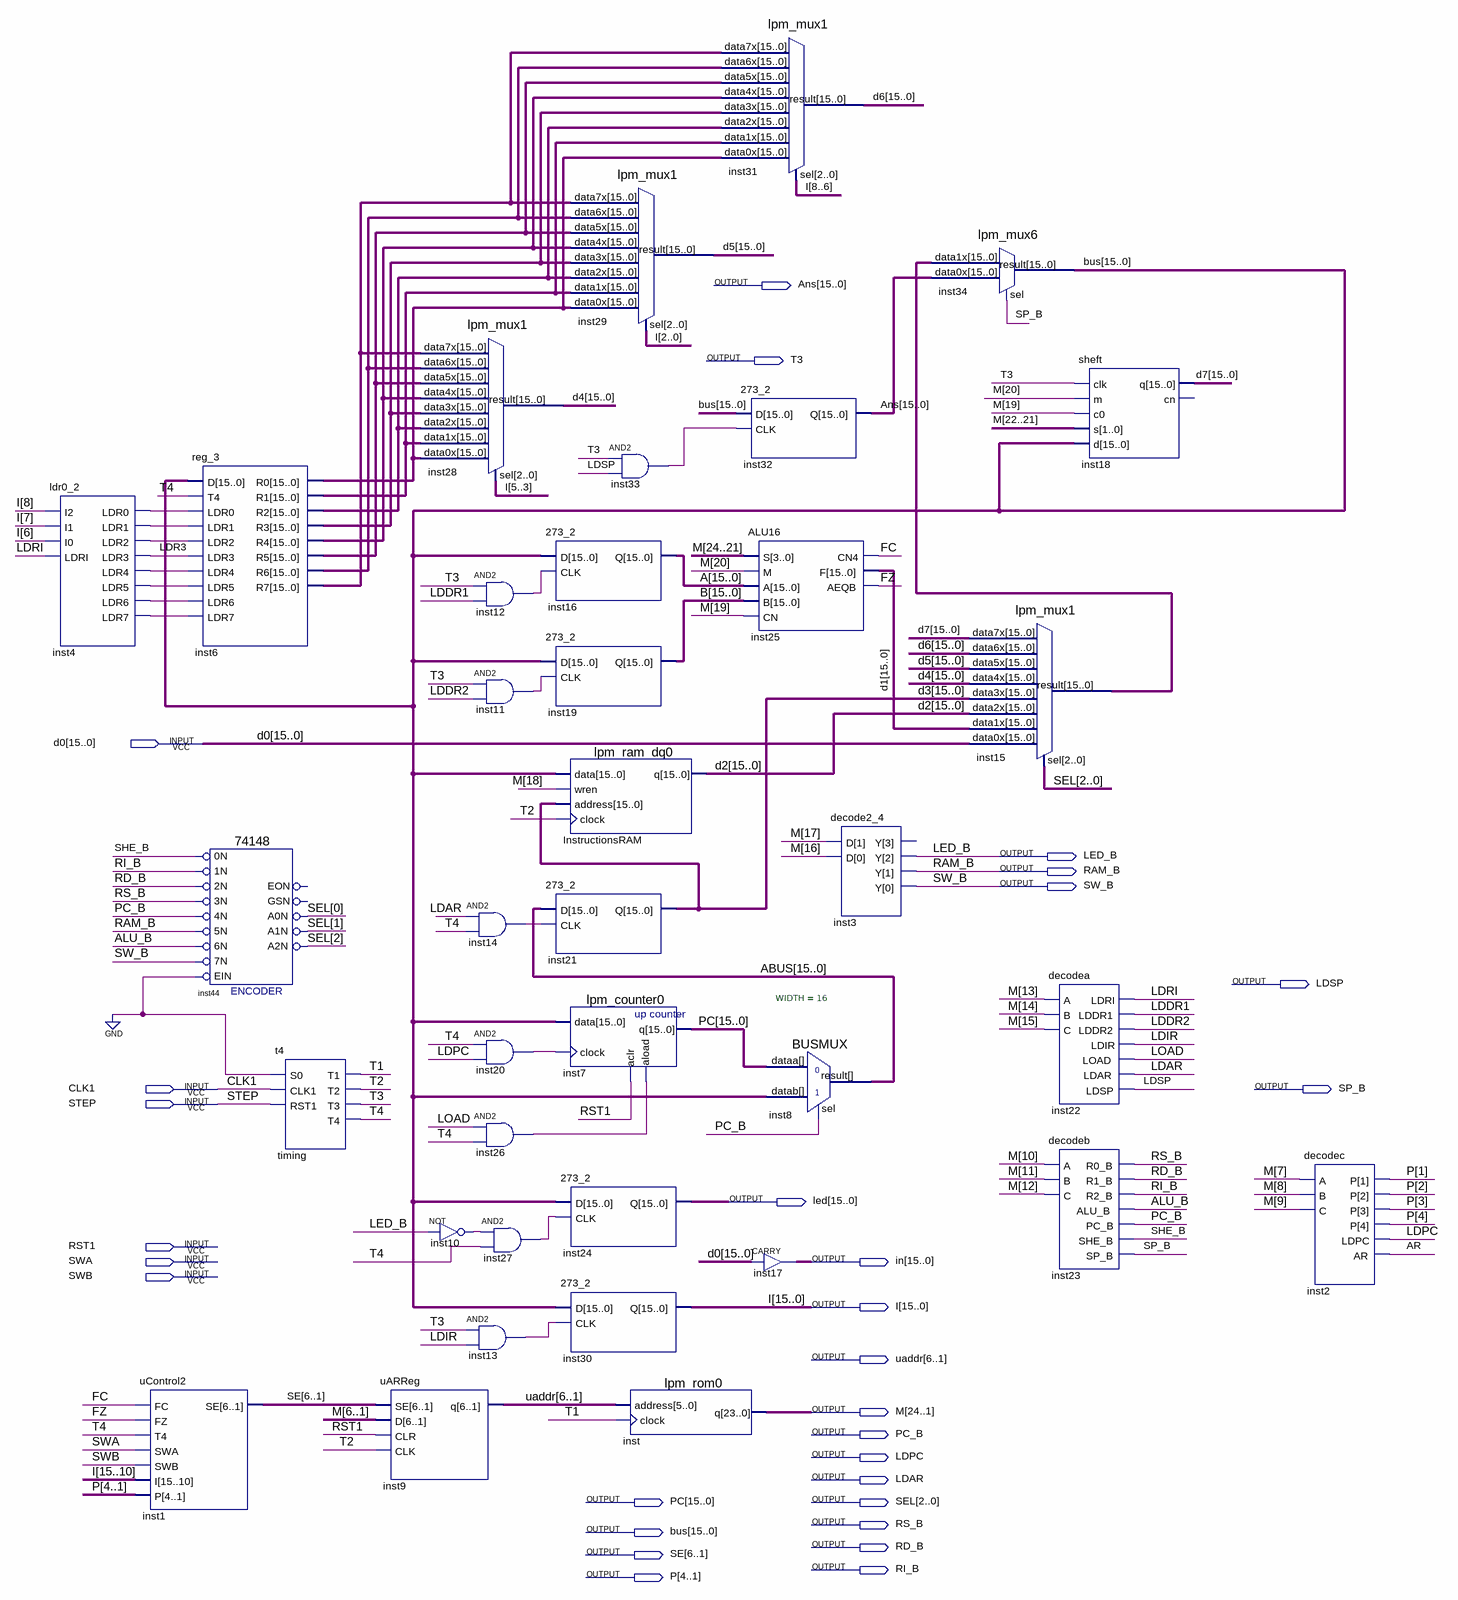
[diagram p0: schematic sheet]
// Quartus schematic Computer.bdf as structural Verilog: 37 symbols, 29 pins
module Computer (
  input  [15:0] d0,
  input  CLK1,
  input  STEP,
  input  RST1,
  input  SWA,
  input  SWB,
  output [15:0] Ans,
  output T3,
  output LED_B,
  output RAM_B,
  output SW_B,
  output LDSP,
  output SP_B,
  output [15:0] led,
  output [15:0] in,
  output [15:0] I,
  output [6:1] uaddr,
  output [24:1] M,
  output PC_B,
  output LDPC,
  output LDAR,
  output [15:0] PC,
  output [2:0] SEL,
  output RS_B,
  output [15:0] bus,
  output RD_B,
  output [6:1] SE,
  output RI_B,
  output [4:1] P
);

  wire ALU_B, AR, FC, FZ, inst4_ldr0, inst4_ldr1, inst4_ldr2, inst4_ldr4, inst4_ldr5, inst4_ldr6, inst4_ldr7,
       inst10_out, inst11_out, inst12_out, inst13_out, inst14_out, inst20_out, inst26_out, inst27_out,
       inst33_out, LDDR1, LDDR2, LDIR, LDR3, LDRI, LOAD, SHE_B, T1, T2, T4;
  wire [15:0] A, ABUS, B, d1, d2, d3, d4, d5, d6, d7, inst6_r0, inst6_r1, inst6_r2, inst6_r3, inst6_r4,
       inst6_r5, inst6_r6, inst6_r7, inst15_result;
  wire [3:0] inst3_y_open;  // unused outputs

  ldr0_2 inst4 (
    .I2(I[8]), .I1(I[7]), .I0(I[6]), .LDRI(LDRI), .LDR0(inst4_ldr0), .LDR1(inst4_ldr1), .LDR2(inst4_ldr2),
    .LDR3(LDR3), .LDR4(inst4_ldr4), .LDR5(inst4_ldr5), .LDR6(inst4_ldr6), .LDR7(inst4_ldr7));
  uControl2 inst1 (.FC(FC), .FZ(FZ), .T4(T4), .SWA(SWA), .SWB(SWB), .I(I[15:10]), .P(P), .SE(SE));
  reg_3 inst6 (
    .D(bus), .T4(T4), .LDR0(inst4_ldr0), .LDR1(inst4_ldr1), .LDR2(inst4_ldr2), .LDR3(LDR3),
    .LDR4(inst4_ldr4), .LDR5(inst4_ldr5), .LDR6(inst4_ldr6), .LDR7(inst4_ldr7), .R0(inst6_r0), .R1(inst6_r1),
    .R2(inst6_r2), .R3(inst6_r3), .R4(inst6_r4), .R5(inst6_r5), .R6(inst6_r6), .R7(inst6_r7));
  \74148  inst44 (
    .\5N (RAM_B), .\0N (SHE_B), .\1N (RI_B), .\2N (RD_B), .\3N (RS_B), .\4N (PC_B), .EIN(1'b0), .\6N (ALU_B),
    .\7N (SW_B), .A1N(SEL[1]), .A0N(SEL[0]), .A2N(SEL[2]));  // open: EON, GSN
  t4 timing (.S0(1'b0), .CLK1(CLK1), .RST1(STEP), .T1(T1), .T2(T2), .T3(T3), .T4(T4));
  uARReg inst9 (.SE(SE), .D(M[6:1]), .CLR(RST1), .CLK(T2), .q(uaddr));
  lpm_mux1 inst28 (
    .data7x(inst6_r7), .data6x(inst6_r6), .data5x(inst6_r5), .data4x(inst6_r4), .data3x(inst6_r3),
    .data2x(inst6_r2), .data1x(inst6_r1), .data0x(inst6_r0), .sel(I[5:3]), .result(d4));
  and inst12 (inst12_out, T3, LDDR1);
  and inst11 (inst11_out, T3, LDDR2);
  and inst14 (inst14_out, LDAR, T4);
  and inst20 (inst20_out, T4, LDPC);
  and inst26 (inst26_out, LOAD, T4);
  not inst10 (inst10_out, LED_B);
  and inst13 (inst13_out, T3, LDIR);
  and inst27 (inst27_out, inst10_out, T4);
  lpm_mux1 inst29 (
    .data7x(inst6_r7), .data6x(inst6_r6), .data5x(inst6_r5), .data4x(inst6_r4), .data3x(inst6_r3),
    .data2x(inst6_r2), .data1x(inst6_r1), .data0x(inst6_r0), .sel(I[2:0]), .result(d5));
  \273_2  inst16 (.D(bus), .CLK(inst12_out), .Q(A));
  \273_2  inst19 (.D(bus), .CLK(inst11_out), .Q(B));
  lpm_ram_dq0 InstructionsRAM (.data(bus), .wren(M[18]), .address(d3), .clock(T2), .q(d2));
  \273_2  inst21 (.D(ABUS), .CLK(inst14_out), .Q(d3));
  lpm_counter0 inst7 (.data(bus), .clock(inst20_out), .aclr(RST1), .aload(inst26_out), .q(PC));
  \273_2  inst24 (.D(bus), .CLK(inst27_out), .Q(led));
  \273_2  inst30 (.D(bus), .CLK(inst13_out), .Q(I));
  and inst33 (inst33_out, T3, LDSP);
  lpm_rom0 inst (.address(uaddr), .clock(T1), .q(M));
  lpm_mux1 inst31 (
    .data7x(inst6_r7), .data6x(inst6_r6), .data5x(inst6_r5), .data4x(inst6_r4), .data3x(inst6_r3),
    .data2x(inst6_r2), .data1x(inst6_r1), .data0x(inst6_r0), .sel(I[8:6]), .result(d6));
  \273_2  inst32 (.D(bus), .CLK(inst33_out), .Q(Ans));
  ALU16 inst25 (.S(M[24:21]), .M(M[20]), .A(A), .B(B), .CN(M[19]), .CN4(FC), .F(d1), .AEQB(FZ));
  BUSMUX #(.WIDTH(16)) inst8 (.datab(bus), .sel(PC_B), .dataa(PC), .result(ABUS));
  CARRY inst17[15:0] (.IN(d0), .OUT(in));
  decode2_4 inst3 (.D(M[17:16]), .Y({inst3_y_open[3], LED_B, RAM_B, SW_B}));
  lpm_mux6 inst34 (.data1x(inst15_result), .data0x(Ans), .sel(SP_B), .result(bus));
  lpm_mux1 inst15 (
    .data7x(d7), .data6x(d6), .data5x(d5), .data4x(d4), .data3x(d3), .data2x(d2), .data1x(d1), .data0x(d0),
    .sel(SEL), .result(inst15_result));
  sheft inst18 (.clk(T3), .m(M[20]), .c0(M[19]), .s(M[22:21]), .d(bus), .q(d7));  // open: cn
  decodea inst22 (
    .A(M[13]), .B(M[14]), .C(M[15]), .LDRI(LDRI), .LDDR1(LDDR1), .LDDR2(LDDR2), .LDIR(LDIR), .LOAD(LOAD),
    .LDAR(LDAR), .LDSP(LDSP));
  decodeb inst23 (
    .A(M[10]), .B(M[11]), .C(M[12]), .R0_B(RS_B), .R1_B(RD_B), .R2_B(RI_B), .ALU_B(ALU_B), .PC_B(PC_B),
    .SHE_B(SHE_B), .SP_B(SP_B));
  decodec inst2 (.A(M[7]), .B(M[8]), .C(M[9]), .P(P), .LDPC(LDPC), .AR(AR));
endmodule
